# EasyEDA Pro project pcb工程文件.epro, board sonsor-1
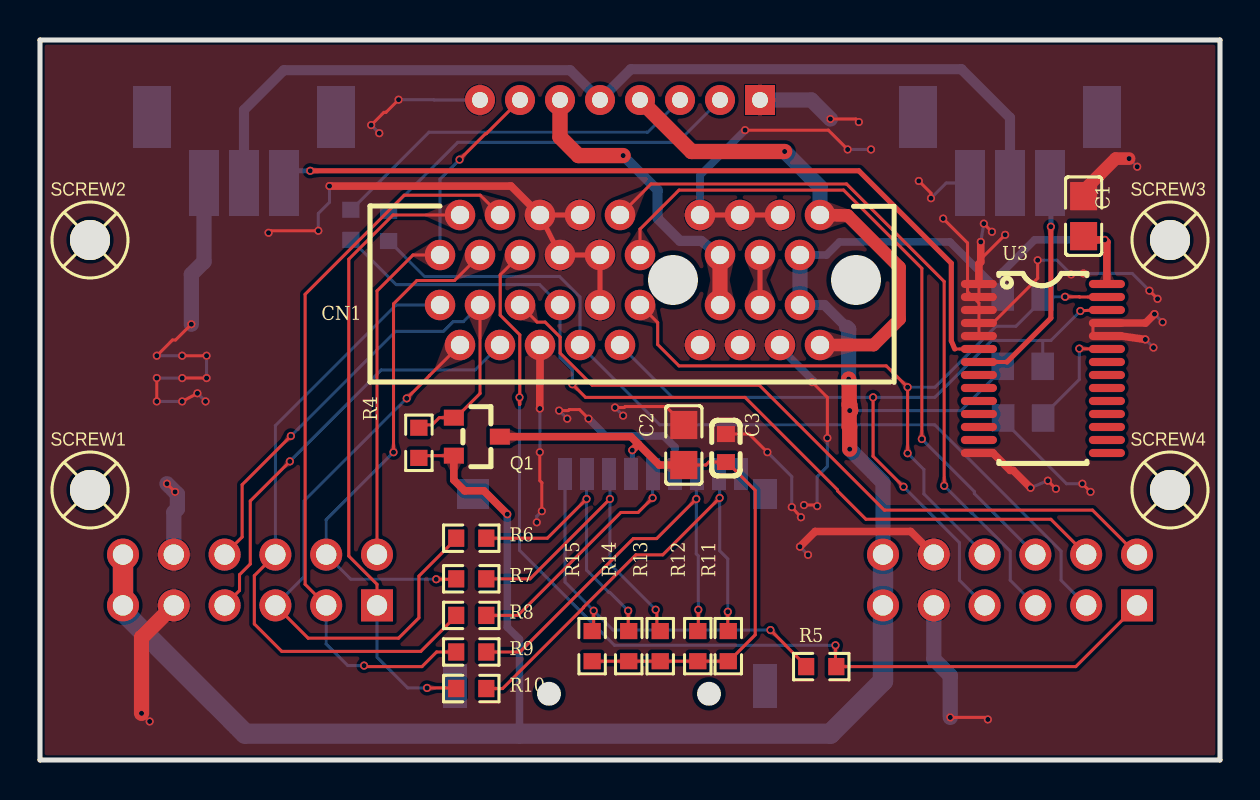
[diagram p2: board, top side]
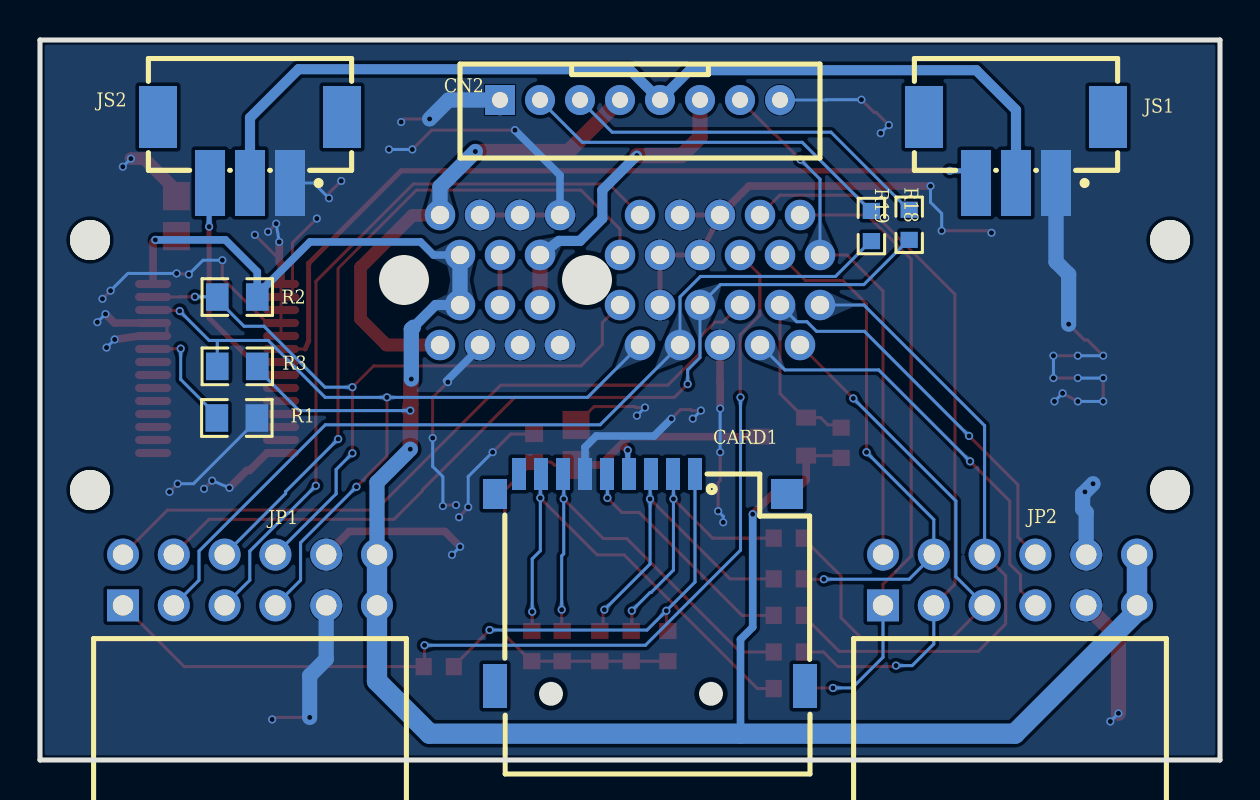
[diagram p3: board, bottom side, seen from below]

Outline 59 x 36 mm; copper layers: Top Layer, Bottom Layer. Coordinates in mm from the lower left corner of the outline.
Outline path: 0,36 59,36 59,0 0,0 0,36
Stack: Top Layer 0.035mm / SUBSTRATE1 1.51mm er 5 / Bottom Layer 0.035mm

## Design rules (mm)
spacing safeClearance (default): track to track 0.152, other pairs 0 to 0.406
track width trackWidth (default): min 0.102, default 0.102, max 1.016
differential pair differentialPair (default): width min 0.127, default 0.254, max 2.54; gap min 0.152, default 0.152
via viaSize (default): diameter min 0.5, default 0.61, max 10; hole min 0.3, default 0.305, max 6
net GND uses POR99922374
pour ie1788 uses POR27610166
pour ie1789 uses POR99922374

## Placement (name value [footprint] x y rotation side)
C1  100nF  [C0805]  52.18 27.19 270 top
C2  100nF  [C0805]  32.19 15.75 90 top
C3  10uF  [C0603]  34.3 15.6 90 top
CARD1  TF PUSH  [TF-SMD_TF-PUSH]  28.5 9 180 bottom
CN1  3183-10200P1T  [CONN-TH_36P-P1.00-V_3183-XXXXXPXT]  29.5 24 0 top
CN2  WAFER-PH2.0-8PZZ  [CONN-TH_8P-P2.00_HDGC2001WV-8P]  29 33 180 bottom
JP1  HC-PM254-8.5H-2x6PW  [CONN-TH_HC-PM254-8.5H-2X6PW]  48.5 9 180 bottom
JP2  HC-PM254-8.5H-2x6PW  [CONN-TH_HC-PM254-8.5H-2X6PW]  10.5 9 180 bottom
JS1  WAFER-PH2.0-3PLB  [CONN-SMD_3P-P2.00_XUNPU_WAFER-PH2.0-3PLB]  10.2 30.5 0 bottom
JS2  WAFER-PH2.0-3PLB  [CONN-SMD_3P-P2.00_XUNPU_WAFER-PH2.0-3PLB]  48.5 30.5 0 bottom
Q1  AO3401A  [SOT-23_L2.9-W1.3-P1.90-LS2.4-BR]  21.84 16.17 180 top
R1  10kΩ  [R0805]  49.16 17.1 180 bottom
R2  4.7kΩ  [R0805]  49.13 23.15 180 bottom
R3  4.7kΩ  [R0805]  49.13 19.68 180 bottom
R4  10kΩ  [R0603]  18.94 15.86 270 top
R5  0Ω  [R0603]  39.06 4.67 180 top
R6  0Ω  [R0603]  21.56 11.09 0 top
R7  0Ω  [R0603]  21.56 9.06 0 top
R8  0Ω  [R0603]  21.56 7.23 0 top
R9  0Ω  [R0603]  21.56 5.4 0 top
R10  0Ω  [R0603]  21.56 3.57 0 top
R11  510kΩ  [R0603]  34.41 5.69 270 top
R12  510kΩ  [R0603]  32.89 5.69 270 top
R13  510kΩ  [R0603]  31.01 5.69 270 top
R14  510kΩ  [R0603]  29.44 5.69 270 top
R15  510kΩ  [R0603]  27.61 5.69 270 top
R18  22Ω  [R0603]  15.54 26.76 90 bottom
R19  22Ω  [R0603]  17.43 26.7 90 bottom
SCREW1  -  [M2__]  2.5 13.5 0 top
SCREW2  -  [M2__]  2.5 26 0 top
SCREW3  -  [M2__]  56.5 26 0 top
SCREW4  -  [M2__]  56.5 13.5 0 top
U3  -  [TSSOP-28_L9.7-W4.4-P0.65-LS6.4-TL]  50.14 19.58 0 top

## Footprints (pads in the part's own frame, mm; a bottom-side part is the same pattern mirrored in y, then rotated)
C0603
  rect 0.8x0.9 smd: 1(-0.7,0) 2(0.7,0)
C0805
  rect 1.41x1.35 smd: 1(-1,0) 2(1,0)
CONN-SMD_3P-P2.00_XUNPU_WAFER-PH2.0-3PLB
  rect 1.5x3.3 smd: 1(-2,1.65) 2(0,1.65) 3(2,1.65)
  rect 1.9x3.1 smd: 4(4.6,-1.65) 5(-4.6,-1.65)
CONN-TH_8P-P2.00_HDGC2001WV-8P
  rect 1.5x1.5 hole 0.8: 1(-7,0)
  round 1.5 hole 0.8: 2(-5,0) 3(-3,0) 4(-1,0) 5(1,0) 6(3,0) 7(5,0) 8(7,0)
CONN-TH_36P-P1.00-V_3183-XXXXXPXT
  round 1.524 hole 0.914: A1(-9.5,1.25) A2(-8.5,3.25) A3(-7.5,1.25) A4(-6.5,3.25) A5(-5.5,1.25) A6(-4.5,3.25) A7(-3.5,1.25) A8(-2.5,3.25) A9(-1.5,1.25) A10(-0.5,3.25) A11(0.5,1.25) A12(3.5,3.25) A13(4.5,1.25) A14(5.5,3.25) A15(6.5,1.25) A16(7.5,3.25) A17(8.5,1.25) A18(9.5,3.25) B1(-9.5,-1.25) B2(-8.5,-3.25) B3(-7.5,-1.25) B4(-6.5,-3.25) B5(-5.5,-1.25) B6(-4.5,-3.25) B7(-3.5,-1.25) B8(-2.5,-3.25) B9(-1.5,-1.25) B10(-0.5,-3.25) B11(0.5,-1.25) B12(3.5,-3.25) B13(4.5,-1.25) B14(5.5,-3.25) B15(6.5,-1.25) B16(7.5,-3.25) B17(8.5,-1.25) B18(9.5,-3.25)
CONN-TH_HC-PM254-8.5H-2X6PW
  rect 1.6x1.6 hole 1.02: 1(-6.35,-1.27)
  round 1.6 hole 1.02: 2(-6.35,1.27) 3(-3.81,-1.27) 4(-3.81,1.27) 5(-1.27,-1.27) 6(-1.27,1.27) 7(1.27,-1.27) 8(1.27,1.27) 9(3.81,-1.27) 10(3.81,1.27) 11(6.35,-1.27) 12(6.35,1.27)
M2__
  round 2 hole 2: 1(0,0)
R0603
  rect 0.806x0.864 smd: 1(-0.753,0) 2(0.753,0)
R0805
  rect 1.133x1.377 smd: 1(-1,0) 2(1,0)
SOT-23_L2.9-W1.3-P1.90-LS2.4-BR
  rect 1x0.8 smd: 1(1.15,-0.95) 2(1.15,0.95) 3(-1.15,0)
TF-SMD_TF-PUSH
  rect 0.7x1.6 smd: 1(2.25,5.3) 2(1.15,5.3) 3(0.05,5.3) 4(-1.05,5.3) 5(-2.15,5.3) 6(-3.25,5.3) 7(-4.35,5.3) 8(-5.45,5.3) CD(-6.55,5.3)
  rect 1.2x1.5 smd: 10(-7.75,4.3)
  rect 1.2x2.2 smd: 11(-7.75,-5.3) 12(7.75,-5.3)
  rect 1.6x1.5 smd: 13(6.85,4.3)
TSSOP-28_L9.7-W4.4-P0.65-LS6.4-TL
  oval 1.804x0.406 smd: 1(-3.2,4.225) 2(-3.2,3.575) 3(-3.2,2.925) 4(-3.2,2.275) 5(-3.2,1.625) 6(-3.2,0.975) 7(-3.2,0.325) 8(-3.2,-0.325) 9(-3.2,-0.975) 10(-3.2,-1.625) 11(-3.2,-2.275) 12(-3.2,-2.925) 13(-3.2,-3.575) 14(-3.2,-4.225) 15(3.2,-4.225) 16(3.2,-3.575) 17(3.2,-2.925) 18(3.2,-2.275) 19(3.2,-1.625) 20(3.2,-0.975) 21(3.2,-0.325) 22(3.2,0.325) 23(3.2,0.975) 24(3.2,1.625) 25(3.2,2.275) 26(3.2,2.925) 27(3.2,3.575) 28(3.2,4.225)

## Nets
5VIN: CN1.A18 CN1.B18 CN2.4
GND: C1.1 C2.2 C3.2 CARD1.6 CN1.A6 CN1.A7 CN1.A8 CN1.A9 CN1.A12 CN1.A14 CN1.A16 CN1.B6 CN1.B9 CN1.B12 CN1.B14 CN1.B16 CN2.1 CN2.8 JP1.9 JP1.10 JP2.9 JP2.10 JS1.1 JS2.1 R1.2 U3.1 U3.2 U3.3 U3.4 U3.5 U3.14 U3.24 U3.25
VBAT: CN1.A13 CN1.B13 CN2.6
VBUS: CN1.A15 CN1.B15
VCC_3V3: C1.2 CN1.A17 CN1.B17 JP1.11 JP1.12 JP2.11 JP2.12 Q1.2 R2.2 R3.2 R4.2 U3.28
VCC_SERVO: CN2.5 JS1.2 JS2.2
$$$2: CARD1.8 R10.2 R11.1
$$$3: CARD1.7 R9.2 R12.1
$$$4: CARD1.3 R7.2 R13.1
$$$5: CARD1.2 R6.2 R14.1
$$$6: CARD1.1 R5.2 R15.1
$$$7: R1.1 U3.23
$$$8: CARD1.5 R8.2
D+: CN2.2 R19.2
D-: CN2.3 R18.2
IO9: CN1.A4 JP2.3 R9.1
IO10: CN1.A1 CN2.7 JP2.2
IO11: CN1.B1 JP2.6 R8.1
IO12: CN1.B2 JP2.5 R6.1
IO13: CN1.A2 JP2.1 R10.1
IO14: CN1.A3 JP2.4 R7.1
IO21: CN1.B5 JP1.2
IO38: CN1.A11 JP1.6
IO39: CN1.A10 JP1.5
IO40_SCL: CN1.B10 JP1.7 R3.1 U3.26
IO41_SDA: CN1.B11 JP1.8 R2.1 U3.27
IO42: CN1.A5 JP1.1 R5.1
SD_VCC: C2.1 C3.1 CARD1.4 Q1.3 R11.2 R12.2 R13.2 R14.2 R15.2
SERVO0: JS1.3 U3.6
SERVO1: JS2.3 U3.7
UART_RX_IO44: CN1.B4 JP2.7
UART_TX_IO43: CN1.B3 JP2.8 Q1.1 R4.1
USB_D+_IO20: CN1.B8 JP1.3 R19.1
USB_D-_IO19: CN1.B7 JP1.4 R18.1

Pads without a net: CARD1 10 11 12 13 CD; JS1 4 5; JS2 4 5; SCREW1 1; SCREW2 1; SCREW3 1; SCREW4 1; U3 8 9 10 11 12 13 15 16 17 18 19 20 21 22

## Via types
v1: diameter 0.406, hole 0.254, Top Layer to Bottom Layer, 110 vias

## Routing (per net, layer and track width the routed paths; a pad name or vN(x,y) marks a point on that pad's centre or on a via; arc(x,y) is an arc through that point)
5VIN: length 24.4
  Top Layer w0.635: CN1.A18 40.38,27.22 42.97,24.63 42.97,22.04 41.68,20.75 CN1.B18
  Top Layer w0.762: CN2.4 32.57,30.42 v1(37.23,30.42)
  Bottom Layer w0.762: v1(37.23,30.42) 39,28.66 CN1.A18
GND: length 189
  Top Layer w0.152: v1(47.19,26.82) v1(47.6,26.41) ; v1(8.33,19.1) v1(7.11,19.1) ; v1(36.37,15.39) 35.46,16.3 C3.2 ; U3.25 52.65,21.85 52.65,21.2 U3.24 ; v1(27.43,17.06) 26.97,17.52 26.46,17.52 26.41,17.47 v1(25.96,17.47) ; v1(40.38,30.53) 39.42,31.49 v1(35.25,31.49) ; v1(47.39,2.03) 47.29,2.13 v1(45.51,2.13) ; v1(38.86,12.7) 38.81,12.75 v1(38.2,12.75) ; v1(39.52,32.05) 40.79,32.05 v1(40.94,31.9) ; v1(39.37,16.1) 39.37,18.13 v1(38.6,18.89) ; U3.4 47.64,21.85 49.88,24.09 v1(49.88,24.99) ; v1(6.35,13.81) v1(6.75,13.41) ; v1(17.93,33.02) 17.29,32.38 17.19,32.38 v1(16.56,31.75) ; v1(37.59,12.64) v1(38.05,12.14) ; C2.2 32.19,16.78 31.29,17.67 29.26,17.67 29.21,17.62 v1(28.75,17.62) ; v1(7.57,21.79) 6.78,21 6.63,21 v1(5.84,20.21) ; v1(48.26,26.26) 46.94,24.95 U3.2 ; v1(24.99,15.39) 24.99,13.97 25.09,13.86 v1(25.09,12.44) ; v1(50.39,13.97) v1(50.8,13.56) ; v1(11.43,26.36) 11.53,26.46 v1(13.92,26.46) ; v1(45.16,27.07) 46.38,25.85 46.38,23.42 46.94,22.85 U3.5 ; v1(44.55,28.09) 44.55,28.34 v1(43.94,28.95) ; v1(5.84,19.1) v1(5.84,17.93) ; v1(7.11,17.93) v1(7.87,18.33) ; v1(51.56,24.28) v1(52.17,24.33) ; v1(55.47,23.47) v1(55.88,23.06) ; v1(52.12,13.81) v1(52.52,13.41) ; v1(7.11,20.21) v1(8.33,20.21)
  Top Layer w0.254: CN1.A16 CN1.A14 CN1.A12 ; CN1.A8 CN1.A6 CN1.A7 CN1.A9 CN1.B9
  Top Layer w0.381: v1(14.47,28.7) 23.55,28.7 CN1.A6 ; v1(55.72,22.3) 55.28,21.85 U3.25 ; U3.24 54.04,21.2 v1(55.27,21.03) ; CN1.B6 25,18.89 24.99,18.88 v1(24.99,17.57) ; v1(49.53,13.61) 48.66,14.48 48.51,14.48 47.64,15.35 46.94,15.35 ; v1(38,10.66) 38.76,11.43 43.53,11.43 JP1.10 ; v1(47.04,25.9) 47.04,24.9 46.94,24.81 U3.1
  Top Layer w0.635: C1.1 52.06,28.19 52.06,28.35 53.78,30.07 v1(54.46,30.07)
  Top Layer w0.762: v1(5.08,2.33) 5.08,6.12 JP2.9
  Bottom Layer w0.152: v1(47.04,25.9) v1(47.19,26.82) ; JS2.1 45.31,28.85 v1(44.55,28.09) ; v1(8.33,20.21) v1(8.33,19.1) ; v1(52.12,13.81) 51.32,13.81 48.16,16.98 R1.2 ; v1(14.47,28.7) 14.47,27.89 13.92,27.33 v1(13.92,26.46) ; v1(7.11,20.21) v1(5.84,20.21) ; v1(7.11,19.1) v1(5.84,19.1) ; v1(49.88,24.99) 50.85,24.99 v1(51.56,24.28) ; v1(49.53,13.61) v1(50.39,13.97) ; v1(37.59,12.64) 37.59,14.17 v1(36.37,15.39) ; v1(25.09,12.44) 24.84,12.19 v1(24.84,11.88) ; v1(55.27,21.03) v1(55.67,20.62) ; v1(40.38,30.53) v1(41.55,30.53) ; v1(39.37,16.1) 39.37,14.68 38.86,14.17 v1(38.86,12.7) ; v1(28.75,17.62) v1(29.16,17.22) ; v1(24.99,17.57) v1(24.99,15.39) ; v1(16.56,31.75) v1(16.96,31.34) ; v1(52.17,24.33) 54.61,24.33 v1(55.47,23.47) ; v1(7.87,18.33) v1(8.28,17.93) ; v1(55.72,22.3) v1(56.13,21.89) ; CN2.8 19.7,33 19.68,33.02 v1(17.93,33.02) ; v1(5.84,17.93) v1(7.11,17.93) ; v1(54.46,30.07) v1(54.86,29.66) ; v1(5.08,2.33) v1(5.48,1.93) ; v1(25.96,17.47) v1(26.36,17.06) ; v1(38,10.66) v1(38.4,10.26)
  Bottom Layer w0.381: v1(27.43,17.06) 28.29,16.2 31.19,16.2 31.75,15.64 CARD1.6 ; v1(38.6,18.89) 38.67,18.96 36.94,20.69 CN1.B16 ; v1(35.25,31.49) 33,29.24 CN1.A12
  Bottom Layer w0.762: v1(39.52,32.05) 38.57,33 CN2.1 ; JP2.10 6.69,12.38 6.87,12.56 6.87,13.29 v1(6.35,13.81) ; v1(7.57,21.79) 7.57,24.28 8.2,24.91 JS1.1 ; JP1.9 44.69,5.04 45.51,4.22 v1(45.51,2.13)
VBAT: length 15.6
  Top Layer w0.762: CN2.6 26,31.14 26.92,30.22 v1(29.16,30.22) ; CN1.A13 CN1.B13
  Bottom Layer w0.508: CN1.A13 33.05,25.95 32,25.95 30.88,27.07 30.88,28.5 v1(29.16,30.22)
VBUS: length 2.5
  Top Layer w0.254: CN1.A15 CN1.B15
VCC_3V3: length 119.7
  Top Layer w0.152: 40.46,17.78 40.33,17.78 ; R4.2 18.94,15.22 Q1.2
  Top Layer w0.381: Q1.2 20.69,14 21.23,13.46 22.2,13.46 v1(23.37,12.29) ; C1.2 52.18,26.01 v1(53.24,26.01) 53.34,25.9 U3.28
  Top Layer w0.762: v1(40.49,15.54) 40.49,16.66 40.46,16.66 40.46,17.78 ; 40.46,17.78 40.46,18.89 40.43,18.89 v1(40.43,19.05) ; 40.46,17.78 40.49,17.78 40.53,17.48 v1(40.49,17.47)
  Top Layer w1.016: JP2.12 JP2.11
  Bottom Layer w0.152: R3.2 48.13,19.56 46.05,17.47 v1(40.49,17.47)
  Bottom Layer w0.381: v1(23.37,12.29) 23.37,6.64 23.97,6.03 23.97,1.32 ; v1(53.24,26.01) 49.73,26.01 48.13,24.41 R2.2 48.13,23.27 45.5,25.9 39.98,25.9 39.32,25.25 CN1.A17
  Bottom Layer w0.508: CN1.B17 39.22,22.75 40.33,21.64
  Bottom Layer w0.762: v1(40.43,19.05) 40.43,21.53 40.33,21.64 ; CN1.B17 CN1.A17 ; JP1.12 42.15,13.88 v1(40.49,15.54)
  Bottom Layer w1.016: JP1.12 JP1.11 42.15,3.95 39.52,1.32 10.26,1.32 4.15,7.43 JP2.12
VCC_SERVO: length 48.3
  Bottom Layer w0.508: JS2.2 48.5,32.11 46.07,34.54 29.54,34.54 CN2.5 26.51,34.49 12.19,34.49 10.2,32.5 JS1.2
$$$2: length 23.7
  Top Layer w0.152: R11.1 34.39,6.45 v1(34.39,7.41) ; R10.2 23.13,3.57 27.18,7.62 27.18,7.64 29.79,10.26 31.14,10.26 v1(33.98,13.1)
  Bottom Layer w0.152: CARD1.8 33.98,14.3 v1(33.98,13.1) 33.98,10.46 34.39,10.05 v1(34.39,7.41)
$$$3: length 21.6
  Top Layer w0.152: v1(32.81,13.05) 30.83,11.07 29.66,11.07 24,5.4 R9.2 ; R12.1 32.92,6.45 v1(32.92,7.51)
  Bottom Layer w0.152: CARD1.7 32.81,14.3 v1(32.81,13.05) 32.81,10.31 32.92,10.21 v1(32.92,7.51)
$$$4: length 16.9
  Top Layer w0.152: R13.1 30.84,6.45 30.84,7.51 v1(30.78,7.51) ; v1(28.5,13.05) 24.5,9.06 R7.2
  Bottom Layer w0.152: CARD1.3 28.5,14.3 v1(28.5,13.05) 28.5,9.8 v1(30.78,7.51)
$$$5: length 14.6
  Top Layer w0.152: v1(27.33,13.05) 25.37,11.09 R6.2 ; R14.1 29.41,6.45 v1(29.41,7.46)
  Bottom Layer w0.152: CARD1.2 27.33,14.3 v1(27.33,13.05) 27.33,9.5 28.44,8.38 28.5,8.38 v1(29.41,7.46)
$$$6: length 20.3
  Top Layer w0.152: R5.2 38.31,4.7 37.29,5.72 37.29,5.73 v1(36.52,6.5) ; R15.1 27.68,6.45 v1(27.68,7.46)
  Bottom Layer w0.152: CARD1.1 26.25,8.9 v1(27.68,7.46) 28.65,6.5 v1(36.52,6.5)
$$$7: length 6.3
  Top Layer w0.152: v1(51.97,20.57) 52.65,20.55 54.04,20.55
  Bottom Layer w0.152: R1.1 50.16,17.22 51.97,19.03 v1(51.97,20.57)
$$$8: length 12
  Top Layer w0.152: R8.2 23.9,7.23 29.04,12.38 29.9,12.38 v1(30.63,13.1)
  Bottom Layer w0.152: CARD1.5 30.63,14.3 v1(30.63,13.1)
D+: length 18.9
  Bottom Layer w0.152: CN2.2 31.88,30.88 20.89,30.88 17.46,27.45 R19.2
D-: length 18.7
  Bottom Layer w0.152: R18.2 15.57,27.51 19.45,31.39 30.39,31.39 CN2.3
IO9: length 37.4
  Top Layer w0.152: 20.81,5.4 19.83,5.4 19.1,4.67 16.2,4.67 v1(16.2,4.72) ; JP2.3 13.26,8.78 13.26,23.29 18.21,28.24 22.01,28.24 CN1.A4
  Bottom Layer w0.152: JP2.3 14.31,5.8 15.39,4.72 v1(16.2,4.72)
IO10: length 26.5
  Top Layer w0.152: JP2.2 16.85,23.45 18.65,25.25 CN1.A1 ; v1(20.98,30.02) 22.28,31.32 22.32,31.32 CN2.7
  Bottom Layer w0.152: CN1.A1 20,29.04 v1(20.98,30.02)
IO11: length 32.5
  Top Layer w0.152: 20.81,7.23 20.81,7.2 19.04,5.43 12.09,5.43 10.72,6.8 10.72,9.22 JP2.6
  Bottom Layer w0.152: JP2.6 11.77,16.72 17.8,22.75 CN1.B1
IO12: length 29.9
  Top Layer w0.152: CN1.B2 19.47,19.22 19.47,19.22 v1(18.34,18.08) ; JP2.5 13.41,6.09 17.93,6.09 18.95,7.11 18.95,9.2 20.81,11.06 20.81,11.09
  Bottom Layer w0.152: JP2.5 13.21,9.17 13.21,12.95 v1(18.34,18.08)
IO13: length 31.6
  Top Layer w0.152: 20.81,3.57 20.81,3.6 v1(19.35,3.6) ; JP2.1 16.85,8.79 15.44,10.2 15.44,25.04 17.65,27.25 CN1.A2
  Bottom Layer w0.152: v1(19.35,3.6) 18.39,3.6 16.85,5.14 JP2.1
IO14: length 26.3
  Top Layer w0.152: CN1.A3 20.72,23.97 18.84,23.97 17.68,22.81 v1(17.68,15.39) ; v1(19.81,9.04) 20.81,9.04 20.81,9.06
  Bottom Layer w0.152: v1(19.81,9.04) 15.54,9.04 JP2.4 14.31,12.02 v1(17.68,15.39)
IO21: length 36.5
  Top Layer w0.152: CN1.B5 24.85,21.89 25.26,21.89 26.01,21.14 26.01,20.34 27.61,18.74 35.96,18.74 42.21,12.49 52.63,12.49 JP1.2
IO38: length 34.5
  Top Layer w0.152: CN1.A11 30,26.54 31.95,28.5 40.18,28.5 44.09,24.58 v1(44.09,16.05)
  Bottom Layer w0.152: v1(44.09,16.05) 46.72,13.42 46.72,13.32 JP1.6
IO39: length 37
  Top Layer w0.152: v1(45.21,13.71) 45.21,23.92 40.33,28.8 30.55,28.8 CN1.A10
  Bottom Layer w0.152: JP1.5 48.51,8.99 48.51,10.44 46.6,12.35 46.57,12.35 v1(45.21,13.71)
IO40_SCL: length 41.2
  Top Layer w0.152: v1(52.02,22.45) 52.02,22.45 52.65,22.5 U3.26 ; v1(43.18,13.66) 41.65,15.19 v1(41.65,18.13)
  Bottom Layer w0.152: 50.14,20.98 50.54,20.98 v1(52.02,22.45) ; 50.14,20.98 R3.1 ; 50.14,20.98 47.59,20.98 44.74,18.13 v1(41.65,18.13) 31.62,18.13 CN1.B10 ; JP1.7 45.97,8.99 45.97,10.87 v1(43.18,13.66)
IO41_SDA: length 37.6
  Top Layer w0.152: v1(51.25,23.16) 51.97,23.16 51.98,23.15 U3.27 ; v1(43.38,15.34) v1(43.38,18.64) 42.31,19.71 31.95,19.71 30.88,20.77 30.88,21.87 CN1.B11
  Bottom Layer w0.152: JP1.8 44.19,13.31 44.19,14.53 v1(43.38,15.34) ; v1(43.38,18.64) 44.75,18.64 47.8,21.69 48.8,21.69 50.13,23.02 R2.1 50.13,23.16 v1(51.25,23.16)
IO42: length 51.5
  Top Layer w0.152: v1(39.77,5.74) 39.77,4.67 R5.1 51.79,4.67 JP1.1 ; CN1.A5 23.01,24.26 23.01,22.24 23.99,21.26 23.99,17.79 23.97,17.78 v1(23.97,18.13)
  Bottom Layer w0.152: v1(23.97,18.13) 23.97,10.49 28.73,5.74 v1(39.77,5.74)
SD_VCC: length 31.6
  Top Layer w0.152: C2.1 33.29,14.75 33.44,14.9 C3.1 34.35,14.9 35.76,13.48 35.76,6.26 34.44,4.94 R11.2 R12.2 R13.2 R14.2 R15.2
  Top Layer w0.381: Q1.3 29.55,16.17 29.92,15.8 ; 29.92,15.8 v1(29.61,15.49) ; 29.92,15.8 30.96,14.75 C2.1
  Bottom Layer w0.254: CARD1.4 29.61,14.3 v1(29.61,15.49)
SERVO0: length 41.4
  Top Layer w0.152: 46.94,20.55 45.74,20.55
  Top Layer w0.254: v1(13.51,29.46) 40.94,29.46 45.56,24.84 45.56,20.95 45.74,20.55
  Bottom Layer w0.254: v1(13.51,29.46) 12.2,29.46 JS1.3
SERVO1: length 11.3
  Top Layer w0.203: U3.7 48.35,19.9
  Top Layer w0.254: v1(50.54,26.67) 50.54,22.09 48.35,19.9
  Bottom Layer w0.254: JS2.3 50.54,28.85 v1(50.54,26.67)
UART_RX_IO44: length 21.5
  Top Layer w0.152: v1(12.49,14.93) 10.51,12.95 10.51,9.8 9.98,9.26 9.98,8.48 JP2.7
  Bottom Layer w0.152: v1(12.49,14.93) 17.07,19.5 21.75,19.5 CN1.B4
UART_TX_IO43: length 27.7
  Top Layer w0.152: JP2.8 10.11,11.15 10.11,13.76 v1(12.54,16.2) ; R4.1 18.94,16.76 19.6,16.76 19.96,17.12 Q1.1 20.79,17.12 22,18.32 CN1.B3
  Bottom Layer w0.152: CN1.B3 21.16,21.91 20.65,21.91 20.17,21.43 17.78,21.43 v1(12.54,16.2)
USB_D+_IO20: length 44.7
  Bottom Layer w0.152: R19.1 17.46,25.95 19.23,24.18 25.97,24.18 27,23.15 CN1.B8 30.99,16.76 44.73,16.76 51.05,10.44 51.05,8.99 JP1.3
USB_D-_IO19: length 45.3
  Top Layer w0.152: v1(26.62,18.79) 27.28,18.13 35.25,18.13 39.88,13.51 39.88,13.46 41.3,12.04 50.54,12.04 JP1.4
  Bottom Layer w0.152: R18.1 15.57,26.01 17.81,23.77 24.98,23.77 CN1.B7 26,20.12 26.62,19.5 v1(26.62,18.79)

## Copper pours and planes (outline as drawn; the poured copper is in the pictures)
GND on Top Layer: -4.78,37.79 61.67,37.79 61.67,-4.02 -4.78,-4.02
GND on Bottom Layer: -1.58,39.77 59.79,39.77 59.79,-8.64 -1.58,-8.64

Small or netless copper shapes (teardrops, artwork), in the pictures only: 139 on Top Layer, 102 on Bottom Layer
